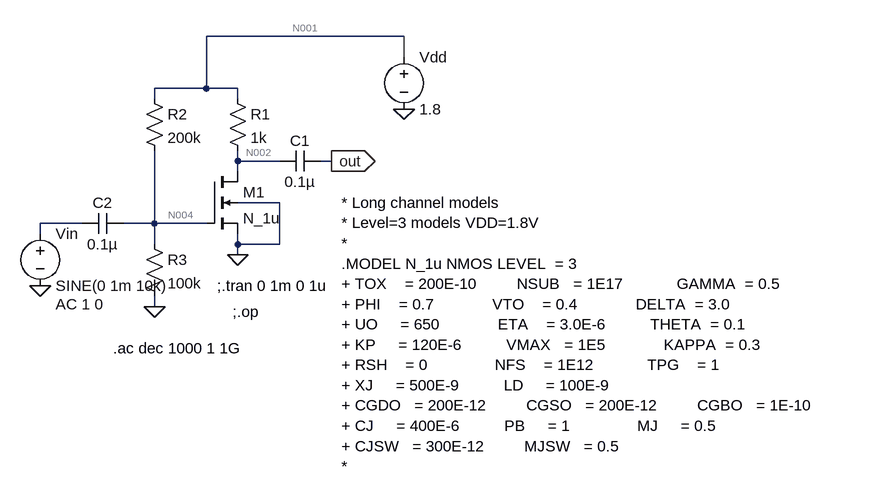
[diagram p0: schematic ac_analysis.asc]
ac_analysis.asc, the LTspice schematic file:
Version 4
SHEET 1 1236 680
WIRE 480 -128 176 -128
WIRE 480 -96 480 -128
WIRE 176 -48 176 -128
WIRE 176 -48 96 -48
WIRE 224 -48 176 -48
WIRE 96 -32 96 -48
WIRE 224 -32 224 -48
WIRE 224 64 224 48
WIRE 288 64 224 64
WIRE 368 64 352 64
WIRE 224 80 224 64
WIRE 288 128 224 128
WIRE -16 160 -80 160
WIRE 96 160 96 48
WIRE 96 160 48 160
WIRE 176 160 96 160
WIRE -80 176 -80 160
WIRE 96 192 96 160
WIRE 224 192 224 176
WIRE 288 192 288 128
WIRE 288 192 224 192
WIRE 224 208 224 192
WIRE 96 288 96 272
FLAG 224 208 0
FLAG 368 64 out
IOPIN 368 64 Out
FLAG 96 288 0
FLAG -80 256 0
FLAG 480 -16 0
SYMBOL nmos4 176 80 R0
SYMATTR InstName M1
SYMATTR Value N_1u
SYMATTR Value2 l=1u w=448u
SYMBOL res 208 -48 R0
SYMATTR InstName R1
SYMATTR Value 1k
SYMBOL cap 352 48 R90
WINDOW 0 0 32 VBottom 2
WINDOW 3 32 32 VTop 2
SYMATTR InstName C1
SYMATTR Value 0.1µ
SYMBOL cap 48 144 R90
WINDOW 0 0 32 VBottom 2
WINDOW 3 32 32 VTop 2
SYMATTR InstName C2
SYMATTR Value 0.1µ
SYMBOL res 80 -48 R0
SYMATTR InstName R2
SYMATTR Value 200k
SYMBOL res 80 176 R0
SYMATTR InstName R3
SYMATTR Value 100k
SYMBOL voltage 480 -112 R0
SYMATTR InstName Vdd
SYMATTR Value 1.8
SYMBOL voltage -80 160 R0
WINDOW 123 24 124 Left 2
WINDOW 39 0 0 Left 0
SYMATTR Value2 AC 1 0
SYMATTR InstName Vin
SYMATTR Value SINE(0 1m 10k)
TEXT 192 256 Left 2 !;.tran 0 1m 0 1u
TEXT 384 128 Left 2 !* Long channel models \n* Level=3 models VDD=1.8V\n*                                                                   \n.MODEL N_1u NMOS LEVEL  = 3                  \n+ TOX    = 200E-10         NSUB   = 1E17            GAMMA  = 0.5          \n+ PHI    = 0.7             VTO    = 0.4             DELTA  = 3.0         \n+ UO     = 650             ETA    = 3.0E-6          THETA  = 0.1          \n+ KP     = 120E-6          VMAX   = 1E5             KAPPA  = 0.3                \n+ RSH    = 0               NFS    = 1E12            TPG    = 1                  \n+ XJ     = 500E-9          LD     = 100E-9                 \n+ CGDO   = 200E-12         CGSO   = 200E-12         CGBO   = 1E-10              \n+ CJ     = 400E-6          PB     = 1               MJ     = 0.5           \n+ CJSW   = 300E-12         MJSW   = 0.5                                  \n*
TEXT 32 352 Left 2 !.ac dec 1000 1 1G
TEXT 216 296 Left 2 !;.op

The netlist it stands for:
* ac_analysis.asc
M1 N002 N004 0 0 N_1u l=1u w=448u
R1 N001 N002 1k
C1 out N002 0.1µ
C2 N004 N003 0.1µ
R2 N001 N004 200k
R3 N004 0 100k
Vdd N001 0 1.8
Vin N003 0 SINE(0 1m 10k) AC 1 0
.model NMOS NMOS
.model PMOS PMOS
.lib standard.mos
;.tran 0 1m 0 1u
* Long channel models
* Level=3 models VDD=1.8V
*
.MODEL N_1u NMOS LEVEL  = 3
+ TOX    = 200E-10         NSUB   = 1E17            GAMMA  = 0.5
+ PHI    = 0.7             VTO    = 0.4             DELTA  = 3.0
+ UO     = 650             ETA    = 3.0E-6          THETA  = 0.1
+ KP     = 120E-6          VMAX   = 1E5             KAPPA  = 0.3
+ RSH    = 0               NFS    = 1E12            TPG    = 1
+ XJ     = 500E-9          LD     = 100E-9
+ CGDO   = 200E-12         CGSO   = 200E-12         CGBO   = 1E-10
+ CJ     = 400E-6          PB     = 1               MJ     = 0.5
+ CJSW   = 300E-12         MJSW   = 0.5
*
.ac dec 1000 1 1G
;.op
.backanno
.end

* Results of the author's LTspice run, read from the files saved beside the schematic
* Operating Point, zero values left out:
*   V(n002) = 200.3 mV
*   V(n004) = 600 mV
*   V(n001) = 1.8 V
*   V(out) = 20.03 nV
*   Id(M1) = 1.6 mA
*   Is(M1) = -1.6 mA
*   I(R3) = 6 µA
*   I(R2) = 6 µA
*   I(R1) = 1.6 mA
*   I(Vdd) = -1.606 mA
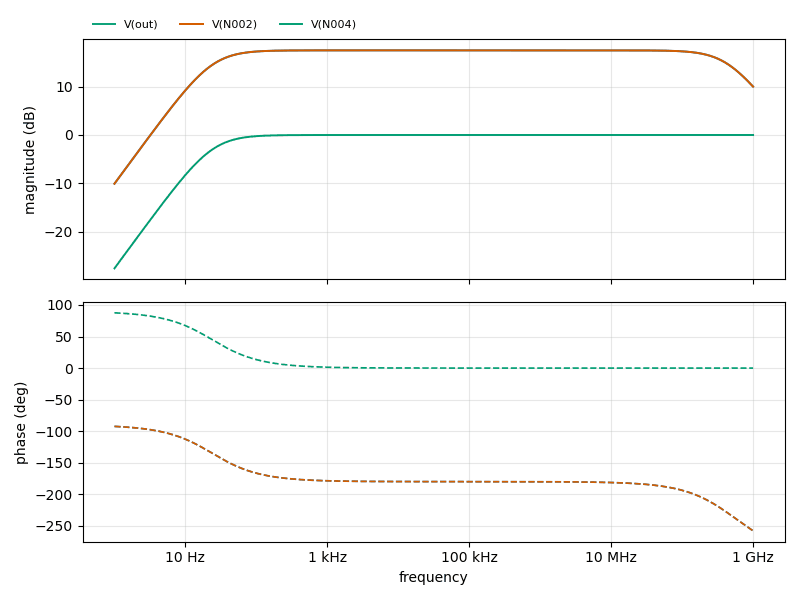
[diagram p1: AC Analysis of ac_analysis.asc, plotted from the saved traces]
* AC Analysis, 1 run:
*   V(out): -10.07 dB at 1 Hz, 10.01 dB at 1 GHz, peak 17.50 dB at 104.2 kHz, 3 dB below the peak at 23.87 Hz and 457.3 MHz
*   V(N002): -10.07 dB at 1 Hz, 10.01 dB at 1 GHz, peak 17.50 dB at 104.2 kHz, 3 dB below the peak at 23.87 Hz and 457.3 MHz
*   V(N004): -27.57 dB at 1 Hz, -0.00 dB at 1 GHz, peak -0.00 dB at 1 GHz, 3 dB below the peak at 23.87 Hz